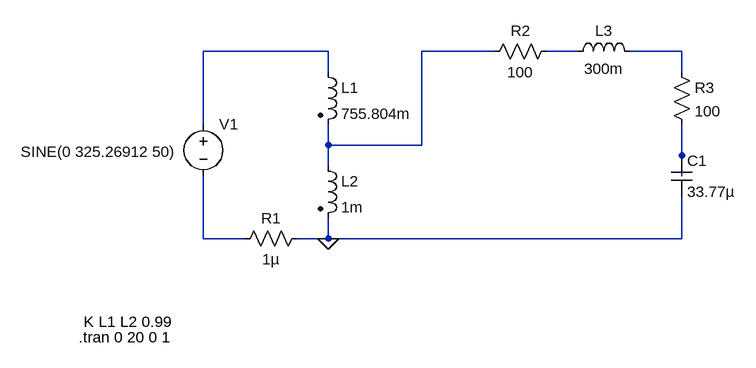
[diagram p0: schematic Expt1_Part1.asc]
Expt1_Part1.asc, the LTspice schematic file:
Version 4
SHEET 1 1092 984
WIRE 64 528 -128 528
WIRE 320 528 208 528
WIRE 448 528 400 528
WIRE 608 528 528 528
WIRE 64 560 64 528
WIRE 608 560 608 528
WIRE -128 640 -128 528
WIRE 64 672 64 640
WIRE 208 672 208 528
WIRE 208 672 64 672
WIRE 608 688 608 640
WIRE 64 704 64 672
WIRE 608 720 608 688
WIRE -128 816 -128 720
WIRE -64 816 -128 816
WIRE 64 816 64 784
WIRE 64 816 16 816
WIRE 608 816 608 752
WIRE 608 816 64 816
FLAG 64 816 0
SYMBOL ind2 48 544 R0
SYMATTR InstName L1
SYMATTR Value 755.804m
SYMATTR Type ind
SYMBOL ind2 48 688 R0
SYMATTR InstName L2
SYMATTR Value 1m
SYMATTR Type ind
SYMBOL voltage -128 624 R0
WINDOW 3 -281 58 Left 2
WINDOW 123 0 0 Left 0
WINDOW 39 0 0 Left 0
SYMATTR Value SINE(0 325.26912 50)
SYMATTR InstName V1
SYMBOL res 416 512 R90
WINDOW 0 0 56 VBottom 2
WINDOW 3 32 56 VTop 2
SYMATTR InstName R2
SYMATTR Value 100
SYMBOL res 592 544 R0
SYMATTR InstName R3
SYMATTR Value 100
SYMBOL ind 432 544 R270
WINDOW 0 32 56 VTop 2
WINDOW 3 5 56 VBottom 2
SYMATTR InstName L3
SYMATTR Value 300m
SYMBOL cap 592 688 R0
SYMATTR InstName C1
SYMATTR Value 33.77µ
SYMBOL res 32 800 R90
WINDOW 0 0 56 VBottom 2
WINDOW 3 32 56 VTop 2
SYMATTR InstName R1
SYMATTR Value 1µ
TEXT -312 944 Left 2 !K L1 L2 0.99
TEXT -320 968 Left 2 !.tran 0 20 0 1

The netlist it stands for:
* Expt1_Part1.asc
L1 N001 N002 755.804m
L2 N002 0 1m
V1 N001 N006 SINE(0 325.26912 50)
R2 N003 N002 100
R3 N004 N005 100
L3 N003 N004 300m
C1 N005 0 33.77µ
R1 0 N006 1µ
K L1 L2 0.99
.tran 0 20 0 1
.backanno
.end